# Altium schematic sheet device-inertia-switch.SchDoc
size 297 x 209 mm
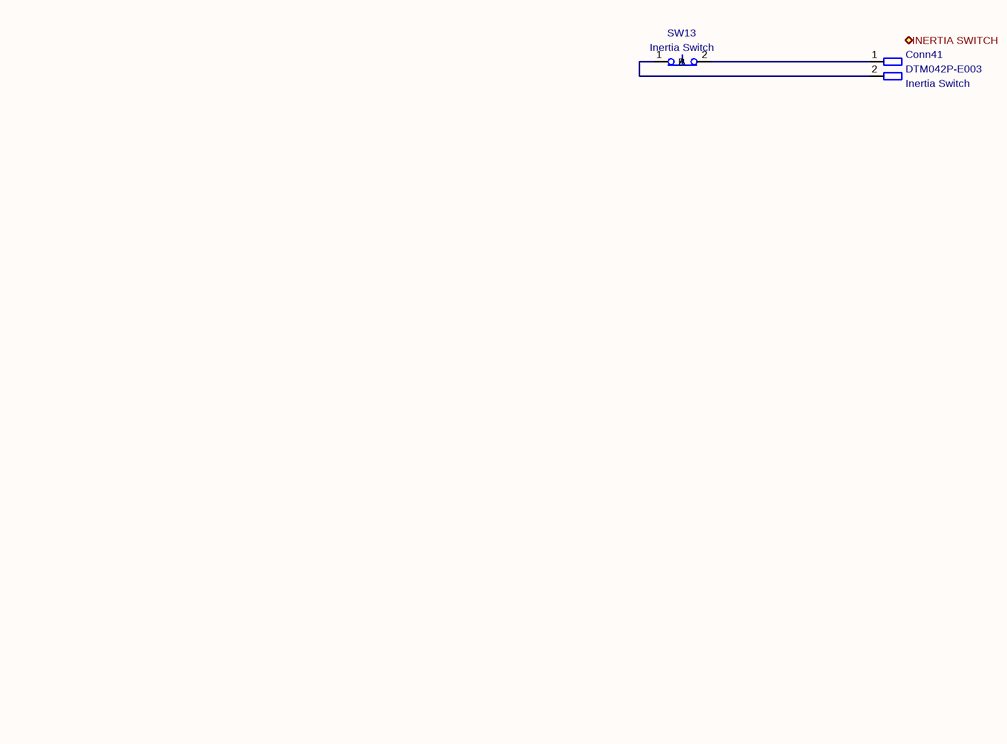
[diagram p0: device-inertia-switch.SchDoc]

## Parts
Conn41  P/N: DTM042P-E003  Conn Name: Inertia Switch  (hidden comment: Deutsch_DTM_2P_Pin)
SW13  Inertia Switch

## Ports
INERTIA SWITCH (bidir)

## Nets
NetConn41_1: Conn41.1 SW13.2(B)
NetConn41_2: Conn41.2 SW13.1(A)

## Notes on the sheet
- 1
- 2
- 3
- 4
- 5
- 6
- A
- B
- C
- D
- Title: DEVICE - INERTIA SWITCH
- File: device-inertia-switch.kicad_sch
- Sheet: /
- KiCad E.D.A.  kicad (5.1.4)-1
- Size: A4
- Date:
- Rev:
- Id: 1/1

## Library data of the parts
SW13 = SW_Push_Open: Value: Inertia Switch
Conn41 = Deutsch_DTM_2P_Pin: Value: Deutsch_DTM_2P_Pin